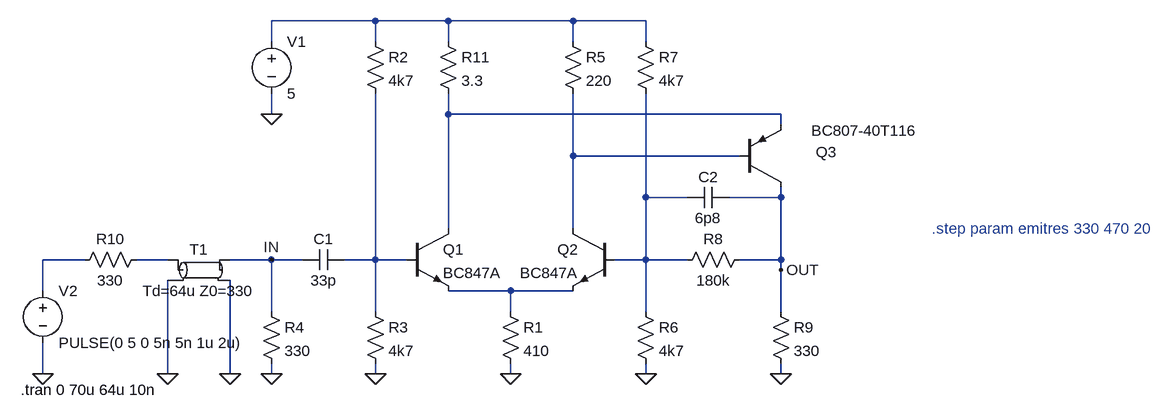
[diagram p0: schematic Draft14.asc]
Draft14.asc, the LTspice schematic file:
Version 4
SHEET 1 1308 680
WIRE 80 -192 -80 -192
WIRE 192 -192 80 -192
WIRE 384 -192 192 -192
WIRE 496 -192 384 -192
WIRE -80 -160 -80 -192
WIRE 80 -160 80 -192
WIRE 192 -160 192 -192
WIRE 384 -160 384 -192
WIRE 496 -160 496 -192
WIRE -80 -48 -80 -80
WIRE 192 -48 192 -80
WIRE 704 -48 192 -48
WIRE 704 -32 704 -48
WIRE 384 16 384 -80
WIRE 640 16 384 16
WIRE 496 80 496 -80
WIRE 560 80 496 80
WIRE 704 80 704 64
WIRE 704 80 624 80
WIRE 192 128 192 -48
WIRE 384 128 384 16
WIRE -368 176 -432 176
WIRE -240 176 -288 176
WIRE -80 176 -144 176
WIRE -32 176 -80 176
WIRE 80 176 80 -80
WIRE 80 176 32 176
WIRE 128 176 80 176
WIRE 496 176 496 80
WIRE 496 176 448 176
WIRE 560 176 496 176
WIRE 704 176 704 80
WIRE 704 176 640 176
WIRE 704 192 704 176
WIRE -432 224 -432 176
WIRE 288 224 192 224
WIRE 384 224 288 224
WIRE -80 256 -80 176
WIRE 80 256 80 176
WIRE 288 256 288 224
WIRE 496 256 496 176
WIRE 704 256 704 192
WIRE -432 352 -432 304
WIRE -240 352 -240 208
WIRE -144 352 -144 208
WIRE -80 352 -80 336
WIRE 80 352 80 336
WIRE 288 352 288 336
WIRE 496 352 496 336
WIRE 704 352 704 336
FLAG 288 352 0
FLAG 80 352 0
FLAG -80 352 0
FLAG 496 352 0
FLAG 704 352 0
FLAG -80 -48 0
FLAG -144 352 0
FLAG -240 352 0
FLAG -432 352 0
FLAG 704 192 OUT
FLAG -80 176 IN
SYMBOL npn 128 128 R0
SYMATTR InstName Q1
SYMATTR Value BC847A
SYMBOL npn 448 128 M0
SYMATTR InstName Q2
SYMATTR Value BC847A
SYMBOL res 272 240 R0
SYMATTR InstName R1
SYMATTR Value 410
SYMBOL cap 32 160 R90
WINDOW 0 0 32 VBottom 2
WINDOW 3 32 32 VTop 2
SYMATTR InstName C1
SYMATTR Value 33p
SYMBOL res 64 -176 R0
SYMATTR InstName R2
SYMATTR Value 4k7
SYMBOL res 64 240 R0
SYMATTR InstName R3
SYMATTR Value 4k7
SYMBOL res -96 240 R0
SYMATTR InstName R4
SYMATTR Value 330
SYMBOL res 368 -176 R0
SYMATTR InstName R5
SYMATTR Value 220
SYMBOL res 480 240 R0
SYMATTR InstName R6
SYMATTR Value 4k7
SYMBOL res 480 -176 R0
SYMATTR InstName R7
SYMATTR Value 4k7
SYMBOL pnp 640 64 M180
WINDOW 0 118 54 Left 2
WINDOW 3 111 87 Left 2
SYMATTR InstName Q3
SYMATTR Value BC807-40T116
SYMBOL res 688 240 R0
SYMATTR InstName R9
SYMATTR Value 330
SYMBOL voltage -80 -176 R0
WINDOW 123 0 0 Left 0
WINDOW 39 0 0 Left 0
SYMATTR InstName V1
SYMATTR Value 5
SYMBOL tline -192 192 R0
SYMATTR InstName T1
SYMATTR Value Td=64u Z0=330
SYMBOL res -272 160 R90
WINDOW 0 0 56 VBottom 2
WINDOW 3 32 56 VTop 2
SYMATTR InstName R10
SYMATTR Value 330
SYMBOL voltage -432 208 R0
WINDOW 123 0 0 Left 0
WINDOW 39 0 0 Left 0
SYMATTR InstName V2
SYMATTR Value PULSE(0 5 0 5n 5n 1u 2u)
SYMBOL res 176 -176 R0
SYMATTR InstName R11
SYMATTR Value 3.3
SYMBOL res 656 160 R90
WINDOW 0 0 56 VBottom 2
WINDOW 3 32 56 VTop 2
SYMATTR InstName R8
SYMATTR Value 180k
SYMBOL cap 624 64 R90
WINDOW 0 0 32 VBottom 2
WINDOW 3 32 32 VTop 2
SYMATTR InstName C2
SYMATTR Value 6p8
TEXT -466 376 Left 2 !.tran 0 70u 64u 10n
TEXT 936 128 Left 2 ;.step param emitres 330 470 20

The netlist it stands for:
* Draft14.asc
Q1 N002 N007 N008 0 BC847A
Q2 N003 N004 N008 0 BC847A
R1 N008 0 410
C1 N007 IN 33p
R2 N001 N007 4k7
R3 N007 0 4k7
R4 IN 0 330
R5 N001 N003 220
R6 N004 0 4k7
R7 N001 N004 4k7
Q3 OUT N003 N002 0 BC807-40T116
R9 OUT 0 330
V1 N001 0 5
T1 N006 0 IN 0 Td=64u Z0=330
R10 N006 N005 330
V2 N005 0 PULSE(0 5 0 5n 5n 1u 2u)
R11 N001 N002 3.3
R8 OUT N004 180k
C2 OUT N004 6p8
.model NPN NPN
.model PNP PNP
.lib standard.bjt
.tran 0 70u 64u 10n
* .step param emitres 330 470 20
.backanno
.end